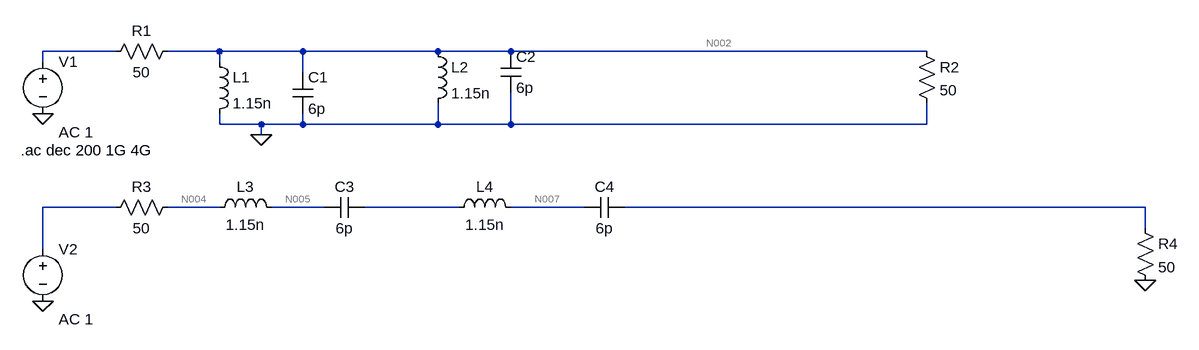
[diagram p0: schematic Draft10.asc]
Draft10.asc, the LTspice schematic file:
Version 4
SHEET 1 2008 680
WIRE -48 144 -160 144
WIRE 112 144 32 144
WIRE 240 144 112 144
WIRE 448 144 240 144
WIRE 560 144 448 144
WIRE 1200 144 560 144
WIRE -160 160 -160 144
WIRE 112 160 112 144
WIRE 240 176 240 144
WIRE 112 256 112 240
WIRE 176 256 112 256
WIRE 240 256 240 240
WIRE 240 256 176 256
WIRE 448 256 448 224
WIRE 448 256 240 256
WIRE 560 256 560 208
WIRE 560 256 448 256
WIRE 1200 256 1200 224
WIRE 1200 256 560 256
WIRE 176 272 176 256
WIRE -48 384 -160 384
WIRE 112 384 32 384
WIRE 272 384 192 384
WIRE 480 384 336 384
WIRE 672 384 560 384
WIRE 1536 384 736 384
WIRE 1536 416 1536 384
WIRE -160 448 -160 384
FLAG 176 272 0
FLAG -160 240 0
FLAG -160 528 0
FLAG 1536 496 0
SYMBOL res 48 128 R90
WINDOW 0 0 56 VBottom 2
WINDOW 3 32 56 VTop 2
SYMATTR InstName R1
SYMATTR Value 50
SYMBOL cap 224 176 R0
SYMATTR InstName C1
SYMATTR Value 6p
SYMBOL ind 96 144 R0
SYMATTR InstName L1
SYMATTR Value 1.15n
SYMBOL voltage -160 144 R0
WINDOW 123 24 124 Left 2
WINDOW 39 0 0 Left 0
SYMATTR InstName V1
SYMATTR Value ""
SYMATTR Value2 AC 1
SYMBOL ind 432 128 R0
SYMATTR InstName L2
SYMATTR Value 1.15n
SYMBOL cap 544 144 R0
SYMATTR InstName C2
SYMATTR Value 6p
SYMBOL voltage -160 432 R0
WINDOW 123 24 124 Left 2
WINDOW 39 0 0 Left 0
SYMATTR InstName V2
SYMATTR Value ""
SYMATTR Value2 AC 1
SYMBOL res 48 368 R90
WINDOW 0 0 56 VBottom 2
WINDOW 3 32 56 VTop 2
SYMATTR InstName R3
SYMATTR Value 50
SYMBOL ind 96 400 R270
WINDOW 0 32 56 VTop 2
WINDOW 3 5 56 VBottom 2
SYMATTR InstName L3
SYMATTR Value 1.15n
SYMBOL cap 336 368 R90
WINDOW 0 0 32 VBottom 2
WINDOW 3 32 32 VTop 2
SYMATTR InstName C3
SYMATTR Value 6p
SYMBOL ind 464 400 R270
WINDOW 0 32 56 VTop 2
WINDOW 3 5 56 VBottom 2
SYMATTR InstName L4
SYMATTR Value 1.15n
SYMBOL cap 736 368 R90
WINDOW 0 0 32 VBottom 2
WINDOW 3 32 32 VTop 2
SYMATTR InstName C4
SYMATTR Value 6p
SYMBOL res 1184 128 R0
SYMATTR InstName R2
SYMATTR Value 50
SYMBOL res 1520 400 R0
SYMATTR InstName R4
SYMATTR Value 50
TEXT -194 296 Left 2 !.ac dec 200 1G 4G

The netlist it stands for:
* Draft10.asc
R1 N002 N001 50
C1 N002 0 6p
L1 N002 0 1.15n
V1 N001 0 AC 1
L2 N002 0 1.15n
C2 N002 0 6p
V2 N003 0 AC 1
R3 N004 N003 50
L3 N004 N005 1.15n
C3 N006 N005 6p
L4 N006 N007 1.15n
C4 N008 N007 6p
R2 N002 0 50
R4 N008 0 50
.ac dec 200 1G 4G
.backanno
.end

* Results of the author's LTspice run, read from the files saved beside the schematic
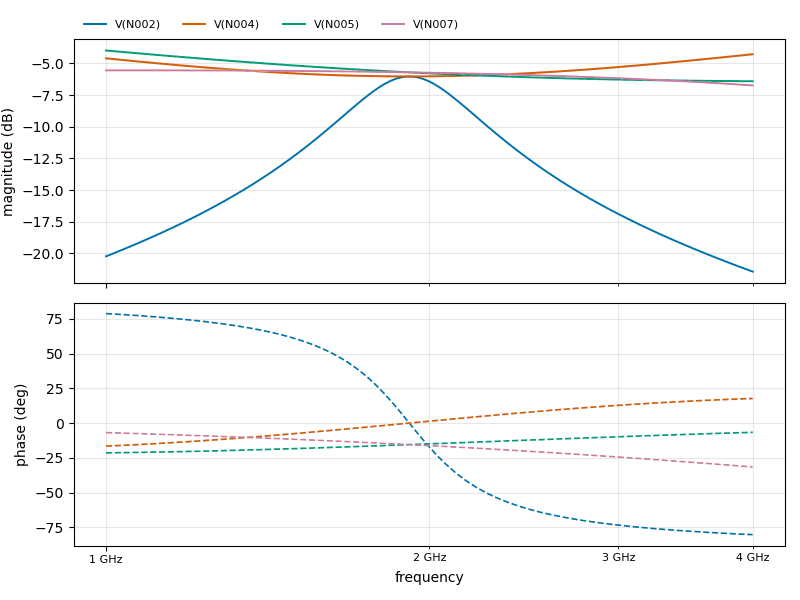
[diagram p1: AC Analysis of Draft10.asc, plotted from the saved traces]
* AC Analysis, 1 run:
*   V(N002): -20.23 dB at 1 GHz, -21.43 dB at 4 GHz, peak -6.03 dB at 1.905 GHz, 3 dB below the peak at 1.669 GHz and 2.2 GHz
*   V(N004): -4.59 dB at 1 GHz, -4.27 dB at 4 GHz, peak -4.27 dB at 4 GHz
*   V(N005): -3.98 dB at 1 GHz, -6.40 dB at 4 GHz, peak -3.98 dB at 1 GHz
*   V(N007): -5.55 dB at 1 GHz, -6.73 dB at 4 GHz, peak -5.54 dB at 1.084 GHz